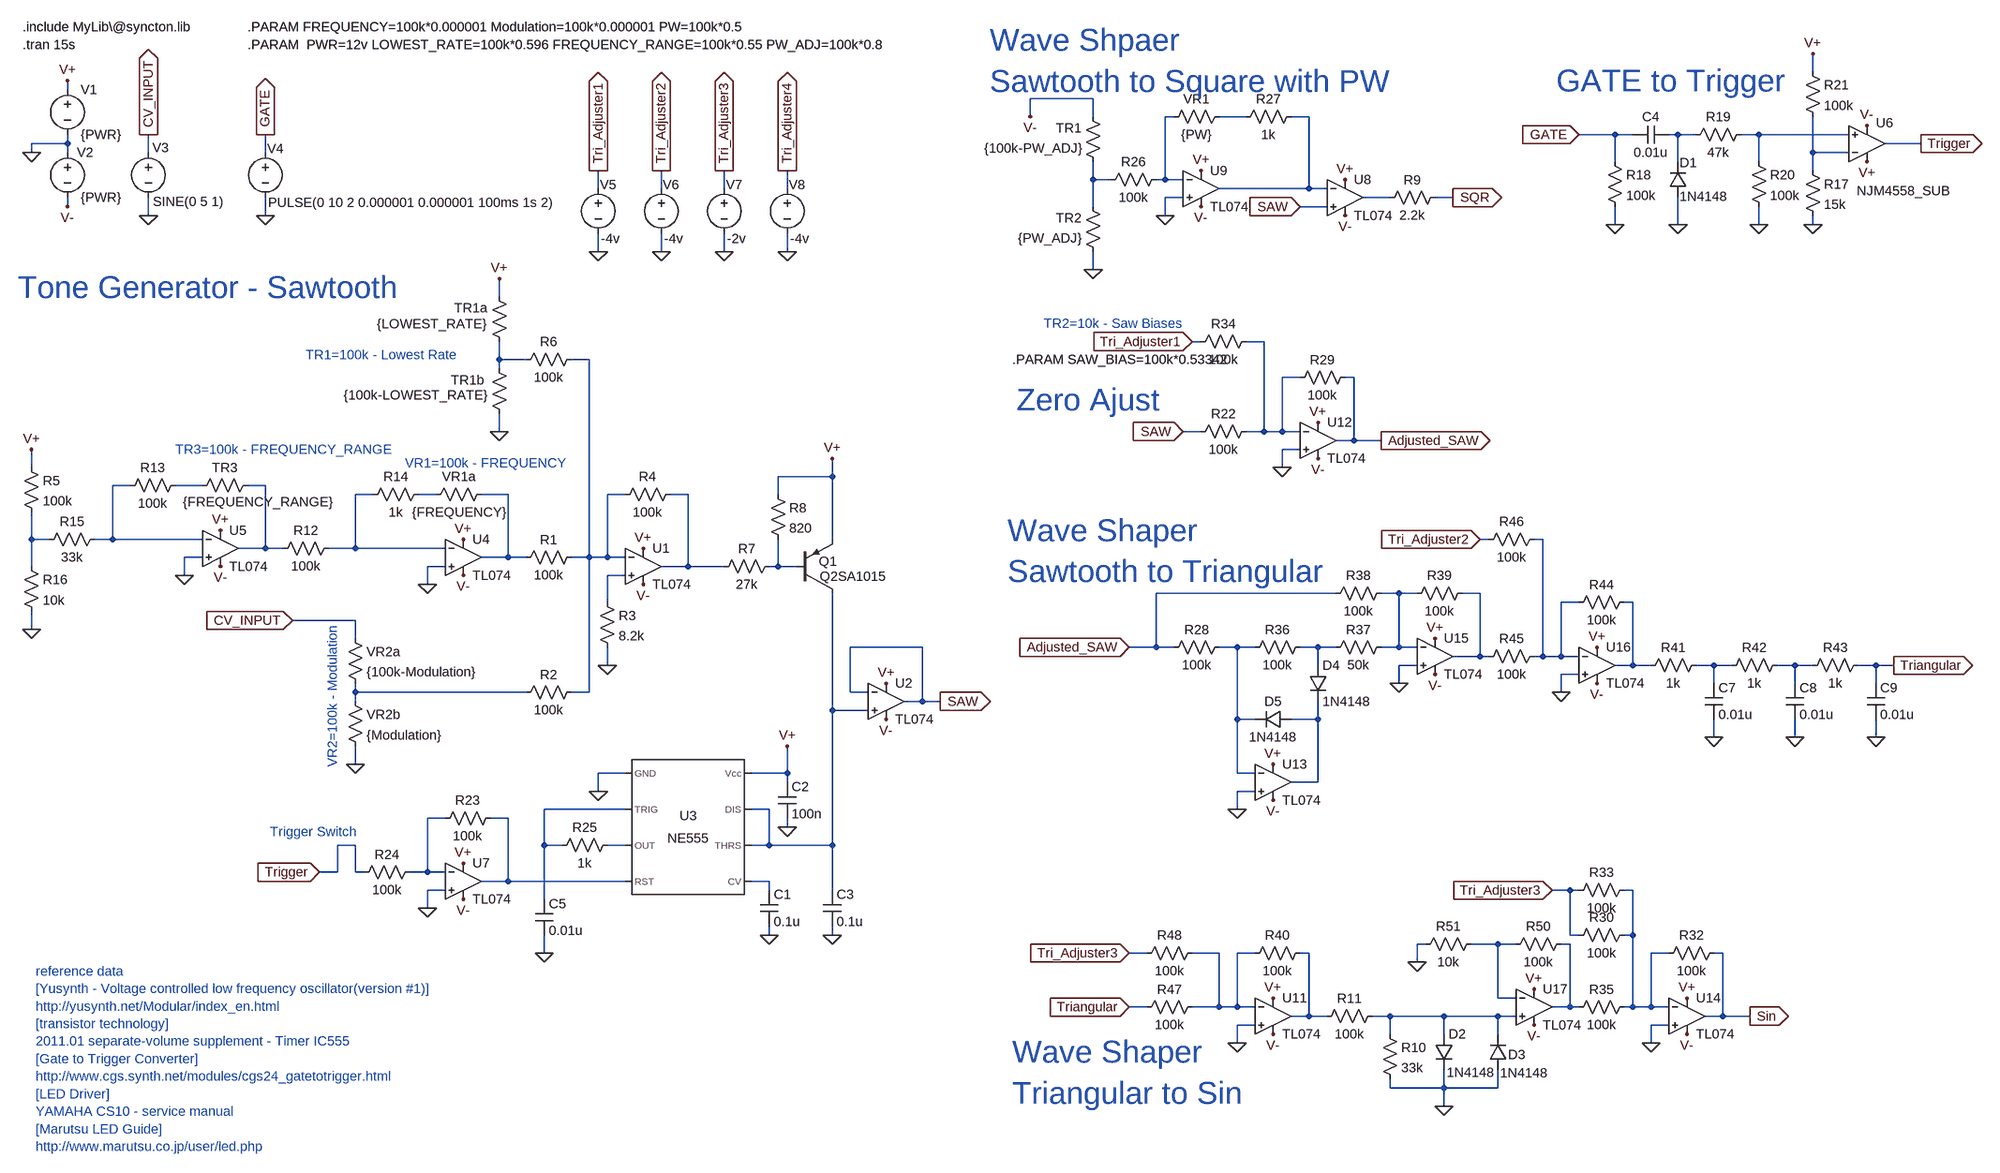
[diagram p0: schematic VCLFO1.asc]
VCLFO1.asc, the LTspice schematic file:
Version 4
SHEET 1 4496 2644
WIRE 2112 368 2112 336
WIRE -992 400 -992 384
WIRE 832 416 720 416
WIRE 720 448 720 416
WIRE 832 448 832 416
WIRE 976 448 960 448
WIRE 1104 448 1056 448
WIRE 1216 448 1184 448
WIRE 1760 480 1696 480
WIRE 1792 480 1760 480
WIRE 1872 480 1856 480
WIRE 1904 480 1872 480
WIRE 2016 480 1984 480
WIRE 2176 480 2016 480
WIRE -992 496 -992 480
WIRE -992 496 -1056 496
WIRE 2304 496 2240 496
WIRE -1056 512 -1056 496
WIRE -992 512 -992 496
WIRE -848 512 -848 480
WIRE -640 512 -640 480
WIRE 2112 512 2112 448
WIRE 2176 512 2112 512
WIRE 1760 528 1760 480
WIRE 1872 528 1872 480
WIRE 2016 528 2016 480
WIRE 2112 544 2112 512
WIRE 832 560 832 528
WIRE 864 560 832 560
WIRE 960 560 960 448
WIRE 960 560 944 560
WIRE 992 560 960 560
WIRE -48 576 -48 544
WIRE 64 576 64 544
WIRE 176 576 176 544
WIRE 288 576 288 544
WIRE 1216 576 1216 448
WIRE 1216 576 1056 576
WIRE 1248 576 1216 576
WIRE 992 592 960 592
WIRE 1360 592 1312 592
WIRE 1472 592 1440 592
WIRE -992 608 -992 592
WIRE 832 608 832 560
WIRE 1248 608 1200 608
WIRE -848 624 -848 592
WIRE -640 624 -640 592
WIRE 960 624 960 592
WIRE 1760 640 1760 608
WIRE 1872 640 1872 592
WIRE 2016 640 2016 608
WIRE 2112 640 2112 624
WIRE -48 688 -48 656
WIRE 64 688 64 656
WIRE 176 688 176 656
WIRE 288 688 288 656
WIRE 832 720 832 688
WIRE -224 768 -224 736
WIRE 1024 848 1008 848
WIRE 1136 848 1104 848
WIRE -224 880 -224 848
WIRE -176 880 -224 880
WIRE -64 880 -96 880
WIRE -224 896 -224 880
WIRE 1200 912 1168 912
WIRE 1296 912 1280 912
WIRE -224 1008 -224 976
WIRE 1024 1008 992 1008
WIRE 1136 1008 1136 848
WIRE 1136 1008 1104 1008
WIRE 1168 1008 1168 912
WIRE 1168 1008 1136 1008
WIRE 1200 1008 1168 1008
WIRE 1296 1024 1296 912
WIRE 1296 1024 1264 1024
WIRE 1344 1024 1296 1024
WIRE 1200 1040 1168 1040
WIRE -1056 1072 -1056 1040
WIRE 1168 1072 1168 1040
WIRE 368 1088 368 1056
WIRE 368 1088 272 1088
WIRE -880 1104 -912 1104
WIRE -752 1104 -800 1104
WIRE -640 1104 -672 1104
WIRE -448 1120 -480 1120
WIRE -336 1120 -368 1120
WIRE -208 1120 -256 1120
WIRE 0 1120 -32 1120
WIRE 112 1120 80 1120
WIRE 272 1120 272 1088
WIRE -1056 1200 -1056 1152
WIRE -1024 1200 -1056 1200
WIRE -912 1200 -912 1104
WIRE -912 1200 -944 1200
WIRE -752 1200 -912 1200
WIRE 368 1200 368 1088
WIRE 1536 1200 1520 1200
WIRE 1632 1200 1616 1200
WIRE -640 1216 -640 1104
WIRE -640 1216 -688 1216
WIRE -608 1216 -640 1216
WIRE -480 1216 -480 1120
WIRE -480 1216 -528 1216
WIRE -320 1216 -480 1216
WIRE -752 1232 -784 1232
WIRE -208 1232 -208 1120
WIRE -208 1232 -256 1232
WIRE -176 1232 -208 1232
WIRE -64 1232 -64 880
WIRE -64 1232 -96 1232
WIRE -32 1232 -32 1120
WIRE -32 1232 -64 1232
WIRE 0 1232 -32 1232
WIRE -1056 1248 -1056 1200
WIRE -320 1248 -352 1248
WIRE 112 1248 112 1120
WIRE 112 1248 64 1248
WIRE 176 1248 112 1248
WIRE 272 1248 272 1200
WIRE 272 1248 256 1248
WIRE 304 1248 272 1248
WIRE -784 1264 -784 1232
WIRE 0 1264 -32 1264
WIRE -352 1280 -352 1248
WIRE 1264 1296 944 1296
WIRE 1376 1296 1344 1296
WIRE 1408 1296 1376 1296
WIRE 1520 1296 1488 1296
WIRE -32 1312 -32 1264
WIRE 1696 1312 1664 1312
WIRE 1792 1312 1776 1312
WIRE -480 1344 -592 1344
WIRE -1056 1360 -1056 1328
WIRE -480 1376 -480 1344
WIRE 528 1392 400 1392
WIRE 944 1392 944 1296
WIRE 944 1392 896 1392
WIRE 976 1392 944 1392
WIRE 1088 1392 1056 1392
WIRE 1120 1392 1088 1392
WIRE 1232 1392 1200 1392
WIRE 1264 1392 1232 1392
WIRE 1376 1392 1376 1296
WIRE 1376 1392 1344 1392
WIRE 1408 1392 1376 1392
WIRE 1520 1408 1520 1296
WIRE 1520 1408 1472 1408
WIRE 1536 1408 1520 1408
WIRE 1632 1408 1632 1200
WIRE 1632 1408 1616 1408
WIRE 1664 1408 1664 1312
WIRE 1664 1408 1632 1408
WIRE 1696 1408 1664 1408
WIRE -32 1424 -32 1392
WIRE 1232 1424 1232 1392
WIRE 1408 1424 1376 1424
WIRE 1792 1424 1792 1312
WIRE 1792 1424 1760 1424
WIRE 1824 1424 1792 1424
WIRE 1936 1424 1904 1424
WIRE 1968 1424 1936 1424
WIRE 2080 1424 2048 1424
WIRE 2112 1424 2080 1424
WIRE 2224 1424 2192 1424
WIRE 2256 1424 2224 1424
WIRE 1696 1440 1664 1440
WIRE 1376 1456 1376 1424
WIRE 1936 1456 1936 1424
WIRE 2080 1456 2080 1424
WIRE 2224 1456 2224 1424
WIRE -480 1472 -480 1456
WIRE -176 1472 -480 1472
WIRE -64 1472 -64 1232
WIRE -64 1472 -96 1472
WIRE 400 1472 400 1392
WIRE 432 1472 400 1472
WIRE 1664 1472 1664 1440
WIRE -480 1488 -480 1472
WIRE 528 1488 528 1392
WIRE 528 1488 496 1488
WIRE 560 1488 528 1488
WIRE 368 1504 368 1296
WIRE 432 1504 368 1504
WIRE 1088 1520 1088 1392
WIRE 1120 1520 1088 1520
WIRE 1232 1520 1232 1488
WIRE 1232 1520 1184 1520
WIRE 1936 1552 1936 1520
WIRE 2080 1552 2080 1520
WIRE 2224 1552 2224 1520
WIRE -480 1600 -480 1568
WIRE 0 1616 -48 1616
WIRE 288 1616 288 1568
WIRE 288 1616 224 1616
WIRE 1088 1616 1088 1520
WIRE 1120 1616 1088 1616
WIRE 288 1632 288 1616
WIRE 1232 1632 1232 1520
WIRE 1232 1632 1184 1632
WIRE -48 1648 -48 1616
WIRE 1120 1648 1088 1648
WIRE 0 1680 -144 1680
WIRE 256 1680 224 1680
WIRE 1088 1680 1088 1648
WIRE -320 1696 -352 1696
WIRE -208 1696 -240 1696
WIRE 288 1712 288 1696
WIRE -480 1744 -512 1744
WIRE -144 1744 -144 1680
WIRE -112 1744 -144 1744
WIRE 0 1744 -32 1744
WIRE 256 1744 256 1680
WIRE 256 1744 224 1744
WIRE 368 1744 368 1504
WIRE 368 1744 256 1744
WIRE -512 1792 -512 1744
WIRE -512 1792 -544 1792
WIRE -480 1792 -480 1744
WIRE -464 1792 -480 1792
WIRE -352 1792 -352 1696
WIRE -352 1792 -384 1792
WIRE -320 1792 -352 1792
WIRE -208 1808 -208 1696
WIRE -208 1808 -256 1808
WIRE 0 1808 -208 1808
WIRE 256 1808 224 1808
WIRE -320 1824 -352 1824
WIRE 256 1824 256 1808
WIRE 368 1824 368 1744
WIRE 1680 1824 1648 1824
WIRE 1696 1824 1680 1824
WIRE 1792 1824 1776 1824
WIRE -144 1840 -144 1744
WIRE -352 1856 -352 1824
WIRE 256 1904 256 1888
WIRE 368 1904 368 1888
WIRE 1680 1904 1680 1824
WIRE 1696 1904 1680 1904
WIRE 1792 1904 1792 1824
WIRE 1792 1904 1776 1904
WIRE 1424 1920 1408 1920
WIRE 1552 1920 1504 1920
WIRE 1584 1920 1552 1920
WIRE 1680 1920 1664 1920
WIRE -144 1936 -144 1904
WIRE 928 1936 896 1936
WIRE 1056 1936 1008 1936
WIRE 1120 1936 1088 1936
WIRE 1216 1936 1200 1936
WIRE 1856 1936 1824 1936
WIRE 1952 1936 1936 1936
WIRE 1408 1952 1408 1920
WIRE 1552 2016 1552 1920
WIRE 1584 2016 1552 2016
WIRE 928 2032 896 2032
WIRE 1056 2032 1056 1936
WIRE 1056 2032 1008 2032
WIRE 1088 2032 1088 1936
WIRE 1088 2032 1056 2032
WIRE 1120 2032 1088 2032
WIRE 1680 2032 1680 1920
WIRE 1680 2032 1648 2032
WIRE 1696 2032 1680 2032
WIRE 1792 2032 1792 1904
WIRE 1792 2032 1776 2032
WIRE 1824 2032 1824 1936
WIRE 1824 2032 1792 2032
WIRE 1856 2032 1824 2032
WIRE 1216 2048 1216 1936
WIRE 1216 2048 1184 2048
WIRE 1248 2048 1216 2048
WIRE 1360 2048 1328 2048
WIRE 1456 2048 1360 2048
WIRE 1552 2048 1456 2048
WIRE 1584 2048 1552 2048
WIRE 1952 2048 1952 1936
WIRE 1952 2048 1920 2048
WIRE 2000 2048 1952 2048
WIRE 1120 2064 1088 2064
WIRE 1856 2064 1824 2064
WIRE 1360 2080 1360 2048
WIRE 1456 2080 1456 2048
WIRE 1552 2080 1552 2048
WIRE 1088 2096 1088 2064
WIRE 1824 2096 1824 2064
WIRE 1360 2176 1360 2160
WIRE 1456 2176 1456 2144
WIRE 1456 2176 1360 2176
WIRE 1552 2176 1552 2144
WIRE 1552 2176 1456 2176
WIRE 1456 2208 1456 2176
FLAG -1056 512 0
FLAG -992 384 V+
FLAG -992 608 V-
FLAG -480 1600 0
FLAG 32 1216 V+
FLAG 32 1280 V-
FLAG -32 1424 0
FLAG -1056 1040 V+
FLAG 368 1056 V+
FLAG -592 1344 CV_INPUT
IOPIN -592 1344 In
FLAG 288 1568 V+
FLAG 256 1904 0
FLAG 288 1712 0
FLAG -848 624 0
FLAG -848 480 CV_INPUT
IOPIN -848 480 Out
FLAG 560 1488 SAW
IOPIN 560 1488 Out
FLAG -784 1264 0
FLAG -352 1280 0
FLAG -720 1184 V+
FLAG -288 1200 V+
FLAG -720 1248 V-
FLAG -288 1264 V-
FLAG -640 624 0
FLAG -640 480 GATE
IOPIN -640 480 Out
FLAG 2112 640 0
FLAG 1760 640 0
FLAG 2016 640 0
FLAG 1696 480 GATE
IOPIN 1696 480 In
FLAG 2112 336 V+
FLAG 2208 528 V+
FLAG 2208 464 V-
FLAG 1872 640 0
FLAG 2304 496 Trigger
IOPIN 2304 496 Out
FLAG -352 1856 0
FLAG -288 1776 V+
FLAG -288 1840 V-
FLAG -48 1648 0
FLAG 368 1904 0
FLAG -1056 1360 0
FLAG -144 1936 0
FLAG -224 1008 0
FLAG -544 1792 Trigger
IOPIN -544 1792 In
FLAG 896 2032 Triangular
IOPIN 896 2032 In
FLAG 1152 2016 V+
FLAG 1152 2080 V-
FLAG 1456 2208 0
FLAG 992 1008 SAW
IOPIN 992 1008 In
FLAG 464 1456 V+
FLAG 464 1520 V-
FLAG 1344 1024 Adjusted_SAW
IOPIN 1344 1024 Out
FLAG 1232 992 V+
FLAG 1232 1056 V-
FLAG 1168 1072 0
FLAG 1152 1600 V+
FLAG 1440 1376 V+
FLAG 1440 1440 V-
FLAG 1152 1664 V-
FLAG 1088 1680 0
FLAG 1376 1456 0
FLAG 2256 1424 Triangular
IOPIN 2256 1424 Out
FLAG 896 1392 Adjusted_SAW
IOPIN 896 1392 In
FLAG 1936 1552 0
FLAG 2080 1552 0
FLAG 2224 1552 0
FLAG 1728 1392 V+
FLAG 1728 1456 V-
FLAG 1664 1472 0
FLAG -48 688 0
FLAG -48 544 Tri_Adjuster1
IOPIN -48 544 Out
FLAG 1520 1200 Tri_Adjuster2
IOPIN 1520 1200 In
FLAG 1008 848 Tri_Adjuster1
IOPIN 1008 848 In
FLAG 64 688 0
FLAG 64 544 Tri_Adjuster2
IOPIN 64 544 Out
FLAG 1088 2096 0
FLAG 896 1936 Tri_Adjuster3
IOPIN 896 1936 In
FLAG 176 688 0
FLAG 176 544 Tri_Adjuster3
IOPIN 176 544 Out
FLAG 1616 2000 V+
FLAG 1616 2064 V-
FLAG 1408 1952 0
FLAG -224 736 V+
FLAG 1280 560 V+
FLAG 1280 624 V-
FLAG 1472 592 SQR
IOPIN 1472 592 Out
FLAG 1200 608 SAW
IOPIN 1200 608 In
FLAG 1024 544 V+
FLAG 1024 608 V-
FLAG 960 624 0
FLAG 720 448 V-
FLAG 832 720 0
FLAG 1888 2016 V+
FLAG 1888 2080 V-
FLAG 1824 2096 0
FLAG 288 688 0
FLAG 288 544 Tri_Adjuster4
IOPIN 288 544 Out
FLAG 2000 2048 Sin
IOPIN 2000 2048 Out
FLAG 1648 1824 Tri_Adjuster3
IOPIN 1648 1824 In
SYMBOL voltage -992 384 R0
WINDOW 123 0 0 Left 2
WINDOW 39 0 0 Left 2
SYMATTR InstName V1
SYMATTR Value {PWR}
SYMBOL voltage -992 496 R0
WINDOW 123 0 0 Left 2
WINDOW 39 0 0 Left 2
WINDOW 0 17 16 Left 2
SYMATTR InstName V2
SYMATTR Value {PWR}
SYMBOL res -352 1136 R270
WINDOW 0 32 56 VTop 2
WINDOW 3 0 56 VBottom 2
SYMATTR InstName VR1a
SYMATTR Value {FREQUENCY}
SYMBOL res -496 1360 R0
SYMATTR InstName VR2a
SYMATTR Value {100k-Modulation}
SYMBOL res -496 1472 R0
SYMATTR InstName VR2b
SYMATTR Value {Modulation}
SYMBOL Opamps\\opamp2 32 1184 R0
SYMATTR InstName U1
SYMATTR Value TL074
SYMBOL res -192 1248 R270
WINDOW 0 32 56 VTop 2
WINDOW 3 0 56 VBottom 2
SYMATTR InstName R1
SYMATTR Value 100k
SYMBOL res -192 1488 R270
WINDOW 0 32 56 VTop 2
WINDOW 3 0 56 VBottom 2
SYMATTR InstName R2
SYMATTR Value 100k
SYMBOL res -48 1296 R0
SYMATTR InstName R3
SYMATTR Value 8.2k
SYMBOL res -16 1136 R270
WINDOW 0 32 56 VTop 2
WINDOW 3 0 56 VBottom 2
SYMATTR InstName R4
SYMATTR Value 100k
SYMBOL res -1072 1056 R0
SYMATTR InstName R5
SYMATTR Value 100k
SYMBOL res -192 896 R270
WINDOW 0 32 56 VTop 2
WINDOW 3 0 56 VBottom 2
SYMATTR InstName R6
SYMATTR Value 100k
SYMBOL res -208 864 R180
WINDOW 0 37 76 Left 2
WINDOW 3 39 47 Left 2
SYMATTR InstName TR1a
SYMATTR Value {LOWEST_RATE}
SYMBOL res -208 992 R180
WINDOW 0 43 75 Left 2
WINDOW 3 37 49 Left 2
SYMATTR InstName TR1b
SYMATTR Value {100k-LOWEST_RATE}
SYMBOL res 160 1264 R270
WINDOW 0 32 56 VTop 2
WINDOW 3 0 56 VBottom 2
SYMATTR InstName R7
SYMATTR Value 27k
SYMBOL res 256 1104 R0
SYMATTR InstName R8
SYMATTR Value 820
SYMBOL pnp 304 1296 M180
WINDOW 0 40 57 Left 2
WINDOW 3 42 30 Left 2
SYMATTR InstName Q1
SYMATTR Value Q2SA1015
SYMBOL Misc\\NE555 112 1712 R0
SYMATTR InstName U3
SYMBOL cap 240 1824 R0
SYMATTR InstName C1
SYMATTR Value 0.1u
SYMBOL cap 272 1632 R0
SYMATTR InstName C2
SYMATTR Value 100n
SYMBOL voltage -848 496 R0
WINDOW 123 0 0 Left 2
WINDOW 39 0 0 Left 2
WINDOW 3 8 103 Left 2
WINDOW 0 7 7 Left 2
SYMATTR Value SINE(0 5 1)
SYMATTR InstName V3
SYMBOL cap 352 1824 R0
SYMATTR InstName C3
SYMATTR Value 0.1u
SYMBOL Opamps\\opamp2 -288 1168 R0
SYMATTR InstName U4
SYMATTR Value TL074
SYMBOL Opamps\\opamp2 -720 1152 R0
SYMATTR InstName U5
SYMATTR Value TL074
SYMBOL res -624 1232 R270
WINDOW 0 32 56 VTop 2
WINDOW 3 0 56 VBottom 2
SYMATTR InstName R12
SYMATTR Value 100k
SYMBOL res -768 1120 R270
WINDOW 0 32 56 VTop 2
WINDOW 3 2 114 VBottom 2
SYMATTR InstName TR3
SYMATTR Value {FREQUENCY_RANGE}
SYMBOL res -1040 1216 R270
WINDOW 0 32 56 VTop 2
WINDOW 3 0 56 VBottom 2
SYMATTR InstName R15
SYMATTR Value 33k
SYMBOL res -1072 1232 R0
SYMATTR InstName R16
SYMATTR Value 10k
SYMBOL voltage -640 496 R0
WINDOW 123 0 0 Left 2
WINDOW 39 0 0 Left 2
WINDOW 3 5 105 Left 2
WINDOW 0 3 9 Left 2
SYMATTR Value PULSE(0 10 2 0.000001 0.000001 100ms 1s 2)
SYMATTR InstName V4
SYMBOL res 2096 528 R0
SYMATTR InstName R17
SYMATTR Value 15k
SYMBOL Opamps\\opamp2 2208 560 M180
WINDOW 0 16 101 Left 2
WINDOW 3 -18 -20 Left 2
SYMATTR InstName U6
SYMATTR Value NJM4558_SUB
SYMBOL res 1744 512 R0
SYMATTR InstName R18
SYMATTR Value 100k
SYMBOL cap 1792 496 R270
WINDOW 0 32 32 VTop 2
WINDOW 3 0 32 VBottom 2
SYMATTR InstName C4
SYMATTR Value 0.01u
SYMBOL res 1888 496 R270
WINDOW 0 32 56 VTop 2
WINDOW 3 0 56 VBottom 2
SYMATTR InstName R19
SYMATTR Value 47k
SYMBOL res 2000 512 R0
SYMATTR InstName R20
SYMATTR Value 100k
SYMBOL res 2096 352 R0
SYMATTR InstName R21
SYMATTR Value 100k
SYMBOL diode 1888 592 R180
WINDOW 0 -18 62 Left 2
WINDOW 3 -72 2 Left 2
SYMATTR InstName D1
SYMATTR Value 1N4148
SYMBOL Opamps\\opamp2 -288 1744 R0
SYMATTR InstName U7
SYMATTR Value TL074
SYMBOL res -336 1712 R270
WINDOW 0 32 56 VTop 2
WINDOW 3 0 56 VBottom 2
SYMATTR InstName R23
SYMATTR Value 100k
SYMBOL res -480 1808 R270
WINDOW 0 32 56 VTop 2
WINDOW 3 0 56 VBottom 2
SYMATTR InstName R24
SYMATTR Value 100k
SYMBOL cap -160 1840 R0
SYMATTR InstName C5
SYMATTR Value 0.01u
SYMBOL res -128 1760 R270
WINDOW 0 32 56 VTop 2
WINDOW 3 0 56 VBottom 2
SYMATTR InstName R25
SYMATTR Value 1k
SYMBOL res -896 1120 R270
WINDOW 0 32 56 VTop 2
WINDOW 3 0 56 VBottom 2
SYMATTR InstName R13
SYMATTR Value 100k
SYMBOL res -464 1136 R270
WINDOW 0 32 56 VTop 2
WINDOW 3 0 56 VBottom 2
SYMATTR InstName R14
SYMATTR Value 1k
SYMBOL Opamps\\opamp2 1152 1984 R0
SYMATTR InstName U11
SYMATTR Value TL074
SYMBOL diode 1440 2080 R0
WINDOW 3 21 68 Left 2
SYMATTR Value 1N4148
SYMATTR InstName D2
SYMBOL diode 1568 2144 R180
WINDOW 0 -33 27 Left 2
WINDOW 3 -73 -5 Left 2
SYMATTR InstName D3
SYMATTR Value 1N4148
SYMBOL res 1344 2064 R0
SYMATTR InstName R10
SYMATTR Value 33k
SYMBOL res 1232 2064 R270
WINDOW 0 32 56 VTop 2
WINDOW 3 0 56 VBottom 2
SYMATTR InstName R11
SYMATTR Value 100k
SYMBOL Opamps\\opamp2 464 1424 R0
SYMATTR InstName U2
SYMATTR Value TL074
SYMBOL res 1008 1024 R270
WINDOW 0 32 56 VTop 2
WINDOW 3 0 56 VBottom 2
SYMATTR InstName R22
SYMATTR Value 100k
SYMBOL Opamps\\opamp2 1232 960 R0
SYMATTR InstName U12
SYMATTR Value TL074
SYMBOL res 1184 928 R270
WINDOW 0 32 56 VTop 2
WINDOW 3 0 56 VBottom 2
SYMATTR InstName R29
SYMATTR Value 100k
SYMBOL res 1008 864 R270
WINDOW 0 32 56 VTop 2
WINDOW 3 0 56 VBottom 2
SYMATTR InstName R34
SYMATTR Value 100k
SYMBOL res 960 1408 R270
WINDOW 0 32 56 VTop 2
WINDOW 3 0 56 VBottom 2
SYMATTR InstName R28
SYMATTR Value 100k
SYMBOL res 1104 1408 R270
WINDOW 0 32 56 VTop 2
WINDOW 3 0 56 VBottom 2
SYMATTR InstName R36
SYMATTR Value 100k
SYMBOL res 1248 1408 R270
WINDOW 0 32 56 VTop 2
WINDOW 3 0 56 VBottom 2
SYMATTR InstName R37
SYMATTR Value 50k
SYMBOL res 1248 1312 R270
WINDOW 0 32 56 VTop 2
WINDOW 3 0 56 VBottom 2
SYMATTR InstName R38
SYMATTR Value 100k
SYMBOL res 1392 1312 R270
WINDOW 0 32 56 VTop 2
WINDOW 3 0 56 VBottom 2
SYMATTR InstName R39
SYMATTR Value 100k
SYMBOL diode 1216 1424 R0
SYMATTR InstName D4
SYMATTR Value 1N4148
SYMBOL diode 1184 1504 R90
WINDOW 0 0 32 VBottom 2
WINDOW 3 32 32 VTop 2
SYMATTR InstName D5
SYMATTR Value 1N4148
SYMBOL Opamps\\opamp2 1152 1568 R0
SYMATTR InstName U13
SYMATTR Value TL074
SYMBOL Opamps\\opamp2 1440 1344 R0
SYMATTR InstName U15
SYMATTR Value TL074
SYMBOL res 1808 1440 R270
WINDOW 0 32 56 VTop 2
WINDOW 3 0 56 VBottom 2
SYMATTR InstName R41
SYMATTR Value 1k
SYMBOL cap 1920 1456 R0
SYMATTR InstName C7
SYMATTR Value 0.01u
SYMBOL res 1952 1440 R270
WINDOW 0 32 56 VTop 2
WINDOW 3 0 56 VBottom 2
SYMATTR InstName R42
SYMATTR Value 1k
SYMBOL cap 2064 1456 R0
SYMATTR InstName C8
SYMATTR Value 0.01u
SYMBOL res 2096 1440 R270
WINDOW 0 32 56 VTop 2
WINDOW 3 0 56 VBottom 2
SYMATTR InstName R43
SYMATTR Value 1k
SYMBOL cap 2208 1456 R0
SYMATTR InstName C9
SYMATTR Value 0.01u
SYMBOL Opamps\\opamp2 1728 1360 R0
SYMATTR InstName U16
SYMATTR Value TL074
SYMBOL res 1680 1328 R270
WINDOW 0 32 56 VTop 2
WINDOW 3 0 56 VBottom 2
SYMATTR InstName R44
SYMATTR Value 100k
SYMBOL res 1520 1424 R270
WINDOW 0 32 56 VTop 2
WINDOW 3 0 56 VBottom 2
SYMATTR InstName R45
SYMATTR Value 100k
SYMBOL res 1520 1216 R270
WINDOW 0 32 56 VTop 2
WINDOW 3 0 56 VBottom 2
SYMATTR InstName R46
SYMATTR Value 100k
SYMBOL voltage -48 560 R0
WINDOW 123 0 0 Left 2
WINDOW 39 0 0 Left 2
WINDOW 3 5 105 Left 2
WINDOW 0 3 9 Left 2
SYMATTR Value -4v
SYMATTR InstName V5
SYMBOL voltage 64 560 R0
WINDOW 123 0 0 Left 2
WINDOW 39 0 0 Left 2
WINDOW 3 5 105 Left 2
WINDOW 0 3 9 Left 2
SYMATTR Value -4v
SYMATTR InstName V6
SYMBOL res 1104 1952 R270
WINDOW 0 32 56 VTop 2
WINDOW 3 0 56 VBottom 2
SYMATTR InstName R40
SYMATTR Value 100k
SYMBOL res 912 2048 R270
WINDOW 0 32 56 VTop 2
WINDOW 3 0 56 VBottom 2
SYMATTR InstName R47
SYMATTR Value 100k
SYMBOL res 912 1952 R270
WINDOW 0 32 56 VTop 2
WINDOW 3 0 56 VBottom 2
SYMATTR InstName R48
SYMATTR Value 100k
SYMBOL voltage 176 560 R0
WINDOW 123 0 0 Left 2
WINDOW 39 0 0 Left 2
WINDOW 3 5 105 Left 2
WINDOW 0 3 9 Left 2
SYMATTR Value -2v
SYMATTR InstName V7
SYMBOL Opamps\\opamp2 1616 1968 R0
SYMATTR InstName U17
SYMATTR Value TL074
SYMBOL res 1568 1936 R270
WINDOW 0 32 56 VTop 2
WINDOW 3 0 56 VBottom 2
SYMATTR InstName R50
SYMATTR Value 100k
SYMBOL res 1408 1936 R270
WINDOW 0 32 56 VTop 2
WINDOW 3 0 56 VBottom 2
SYMATTR InstName R51
SYMATTR Value 10k
SYMBOL Opamps\\opamp2 1280 528 R0
SYMATTR InstName U8
SYMATTR Value TL074
SYMBOL res 848 544 R180
WINDOW 0 36 76 Left 2
WINDOW 3 36 40 Left 2
SYMATTR InstName TR1
SYMATTR Value {100k-PW_ADJ}
SYMBOL res 960 464 R270
WINDOW 0 32 56 VTop 2
WINDOW 3 0 56 VBottom 2
SYMATTR InstName VR1
SYMATTR Value {PW}
SYMBOL res 1344 608 R270
WINDOW 0 32 56 VTop 2
WINDOW 3 0 56 VBottom 2
SYMATTR InstName R9
SYMATTR Value 2.2k
SYMBOL Opamps\\opamp2 1024 512 R0
SYMATTR InstName U9
SYMATTR Value TL074
SYMBOL res 848 576 R270
WINDOW 0 32 56 VTop 2
WINDOW 3 0 56 VBottom 2
SYMATTR InstName R26
SYMATTR Value 100k
SYMBOL res 848 704 R180
WINDOW 0 36 76 Left 2
WINDOW 3 36 40 Left 2
SYMATTR InstName TR2
SYMATTR Value {PW_ADJ}
SYMBOL res 1088 464 R270
WINDOW 0 32 56 VTop 2
WINDOW 3 0 56 VBottom 2
SYMATTR InstName R27
SYMATTR Value 1k
SYMBOL Opamps\\opamp2 1888 1984 R0
SYMATTR InstName U14
SYMATTR Value TL074
SYMBOL res 1840 1952 R270
WINDOW 0 32 56 VTop 2
WINDOW 3 0 56 VBottom 2
SYMATTR InstName R32
SYMATTR Value 100k
SYMBOL res 1680 1840 R270
WINDOW 0 32 56 VTop 2
WINDOW 3 0 56 VBottom 2
SYMATTR InstName R33
SYMATTR Value 100k
SYMBOL res 1680 2048 R270
WINDOW 0 32 56 VTop 2
WINDOW 3 0 56 VBottom 2
SYMATTR InstName R35
SYMATTR Value 100k
SYMBOL voltage 288 560 R0
WINDOW 123 0 0 Left 2
WINDOW 39 0 0 Left 2
WINDOW 3 5 105 Left 2
WINDOW 0 3 9 Left 2
SYMATTR Value -4v
SYMATTR InstName V8
SYMBOL res 1680 1920 R270
WINDOW 0 32 56 VTop 2
WINDOW 3 0 56 VBottom 2
SYMATTR InstName R30
SYMATTR Value 100k
TEXT -1072 288 Left 2 !.include MyLib\\@syncton.lib
TEXT -1072 320 Left 2 !.tran 15s
TEXT -520 1352 VRight 2 ;VR2=100k - Modulation
TEXT -392 1064 Left 2 ;VR1=100k - FREQUENCY
TEXT -568 872 Left 2 ;TR1=100k - Lowest Rate
TEXT -672 288 Left 2 !.PARAM FREQUENCY=100k*0.000001 Modulation=100k*0.000001 PW=100k*0.5
TEXT -672 320 Left 2 !.PARAM  PWR=12v LOWEST_RATE=100k*0.596 FREQUENCY_RANGE=100k*0.55 PW_ADJ=100k*0.8
TEXT 1656 384 Left 5 ;GATE to Trigger
TEXT -800 1040 Left 2 ;TR3=100k - FREQUENCY_RANGE
TEXT -632 1720 Left 2 ;Trigger Switch
TEXT 688 2112 Left 5 ;Wave Shaper\nTriangular to Sin
TEXT 688 880 Left 2 !.PARAM SAW_BIAS=100k*0.53342
TEXT 744 816 Left 2 ;TR2=10k - Saw Biases
TEXT 696 952 Left 5 ;Zero Ajust
TEXT 680 1184 Left 5 ;Wave Shaper\nSawtooth to Triangular
TEXT -1080 752 Left 5 ;Tone Generator - Sawtooth
TEXT 648 312 Left 5 ;Wave Shpaer\nSawtooth to Square with PW
TEXT -1048 1968 Left 2 ;reference data\n[Yusynth - Voltage controlled low frequency oscillator(version #1)]\nhttp://yusynth.net/Modular/index_en.html\n[transistor technology]\n2011.01 separate-volume supplement - Timer IC555\n[Gate to Trigger Converter]\nhttp://www.cgs.synth.net/modules/cgs24_gatetotrigger.html\n[LED Driver]\nYAMAHA CS10 - service manual\n[Marutsu LED Guide]\nhttp://www.marutsu.co.jp/user/led.php

The netlist it stands for:
* VCLFO1.asc
V1 V+ 0 {PWR}
V2 0 V- {PWR}
R§VR1a N016 N017 {FREQUENCY}
R§VR2a CV_INPUT N030 {100k-Modulation}
R§VR2b N030 0 {Modulation}
XU1 N022 N011 V+ V- N018 TL074  ; pins In+ In- V+ V- OUT
R1 N017 N011 100k
R2 N030 N011 100k
R3 N022 0 8.2k
R4 N011 N018 100k
R5 V+ N019 100k
R6 N010 N011 100k
R§TR1a N010 V+ {LOWEST_RATE}
R§TR1b 0 N010 {100k-LOWEST_RATE}
R7 N018 N021 27k
R8 V+ N021 820
Q1 N031 N021 V+ 0 Q2SA1015
XU3 0 N033 N036 N035 N037 N031 N031 V+ NE555  ; pins GND TRIG OUT RST CV THRS DIS Vcc
C1 N037 0 0.1u
C2 V+ 0 100n
V3 CV_INPUT 0 SINE(0 5 1)
C3 N031 0 0.1u
XU4 0 N015 V+ V- N017 TL074  ; pins In+ In- V+ V- OUT
XU5 0 N012 V+ V- N014 TL074  ; pins In+ In- V+ V- OUT
R12 N014 N015 100k
R§TR3 N013 N014 {FREQUENCY_RANGE}
R15 N019 N012 33k
R16 N019 0 10k
V4 GATE 0 PULSE(0 10 2 0.000001 0.000001 100ms 1s 2)
R17 N006 0 15k
XU6 N005 N006 V+ V- Trigger NJM4558_SUB  ; pins In+ In- V+ V- OUT
R18 GATE 0 100k
C4 GATE N004 0.01u
R19 N004 N005 47k
R20 N005 0 100k
R21 V+ N006 100k
D1 0 N004 1N4148
XU7 0 N034 V+ V- N035 TL074  ; pins In+ In- V+ V- OUT
R23 N034 N035 100k
R24 Trigger N034 100k
C5 N033 0 0.01u
R25 N033 N036 1k
R13 N012 N013 100k
R14 N015 N016 1k
XU11 0 N041 V+ V- N042 TL074  ; pins In+ In- V+ V- OUT
D2 N043 0 1N4148
D3 0 N043 1N4148
R10 N043 0 33k
R11 N042 N043 100k
XU2 N031 SAW V+ V- SAW TL074  ; pins In+ In- V+ V- OUT
R22 SAW N009 100k
XU12 0 N009 V+ V- Adjusted_SAW TL074  ; pins In+ In- V+ V- OUT
R29 N009 Adjusted_SAW 100k
R34 Tri_Adjuster1 N009 100k
R28 Adjusted_SAW N026 100k
R36 N026 N027 100k
R37 N027 N023 50k
R38 Adjusted_SAW N023 100k
R39 N023 N024 100k
D4 N027 N032 1N4148
D5 N032 N026 1N4148
XU13 0 N026 V+ V- N032 TL074  ; pins In+ In- V+ V- OUT
XU15 0 N023 V+ V- N024 TL074  ; pins In+ In- V+ V- OUT
R41 N025 N028 1k
C7 N028 0 0.01u
R42 N028 N029 1k
C8 N029 0 0.01u
R43 N029 Triangular 1k
C9 Triangular 0 0.01u
XU16 0 N020 V+ V- N025 TL074  ; pins In+ In- V+ V- OUT
R44 N020 N025 100k
R45 N024 N020 100k
R46 Tri_Adjuster2 N020 100k
V5 Tri_Adjuster1 0 -4v
V6 Tri_Adjuster2 0 -4v
R40 N041 N042 100k
R47 Triangular N041 100k
R48 Tri_Adjuster3 N041 100k
V7 Tri_Adjuster3 0 -2v
XU17 N043 N039 V+ V- N040 TL074  ; pins In+ In- V+ V- OUT
R50 N039 N040 100k
R51 0 N039 10k
XU8 SAW N003 V+ V- N008 TL074  ; pins In+ In- V+ V- OUT
R§TR1 N007 V- {100k-PW_ADJ}
R§VR1 N001 N002 {PW}
R9 N008 SQR 2.2k
XU9 0 N001 V+ V- N003 TL074  ; pins In+ In- V+ V- OUT
R26 N007 N001 100k
R§TR2 0 N007 {PW_ADJ}
R27 N002 N003 1k
XU14 0 N038 V+ V- Sin TL074  ; pins In+ In- V+ V- OUT
R32 N038 Sin 100k
R33 Tri_Adjuster3 N038 100k
R35 N040 N038 100k
V8 Tri_Adjuster4 0 -4v
R30 Tri_Adjuster3 N038 100k
.model D D
.lib standard.dio
.model NPN NPN
.model PNP PNP
.lib standard.bjt
.include MyLib\@syncton.lib
.tran 15s
* VR2=100k - Modulation
* VR1=100k - FREQUENCY
* TR1=100k - Lowest Rate
.PARAM FREQUENCY=100k*0.000001 Modulation=100k*0.000001 PW=100k*0.5
.PARAM  PWR=12v LOWEST_RATE=100k*0.596 FREQUENCY_RANGE=100k*0.55 PW_ADJ=100k*0.8
* GATE to Trigger
* TR3=100k - FREQUENCY_RANGE
* Trigger Switch
* Wave Shaper
* Triangular to Sin
.PARAM SAW_BIAS=100k*0.53342
* TR2=10k - Saw Biases
* Zero Ajust
* Wave Shaper
* Sawtooth to Triangular
* Tone Generator - Sawtooth
* Wave Shpaer
* Sawtooth to Square with PW
* reference data
* [Yusynth - Voltage controlled low frequency oscillator(version #1)]
* http://yusynth.net/Modular/index_en.html
* [transistor technology]
* 2011.01 separate-volume supplement - Timer IC555
* [Gate to Trigger Converter]
* http://www.cgs.synth.net/modules/cgs24_gatetotrigger.html
* [LED Driver]
* YAMAHA CS10 - service manual
* [Marutsu LED Guide]
* http://www.marutsu.co.jp/user/led.php
.lib NE555.sub
.backanno
.end